# EAGLE design ErikSpark_AtTiny85 (EAGLE 7.6.0)
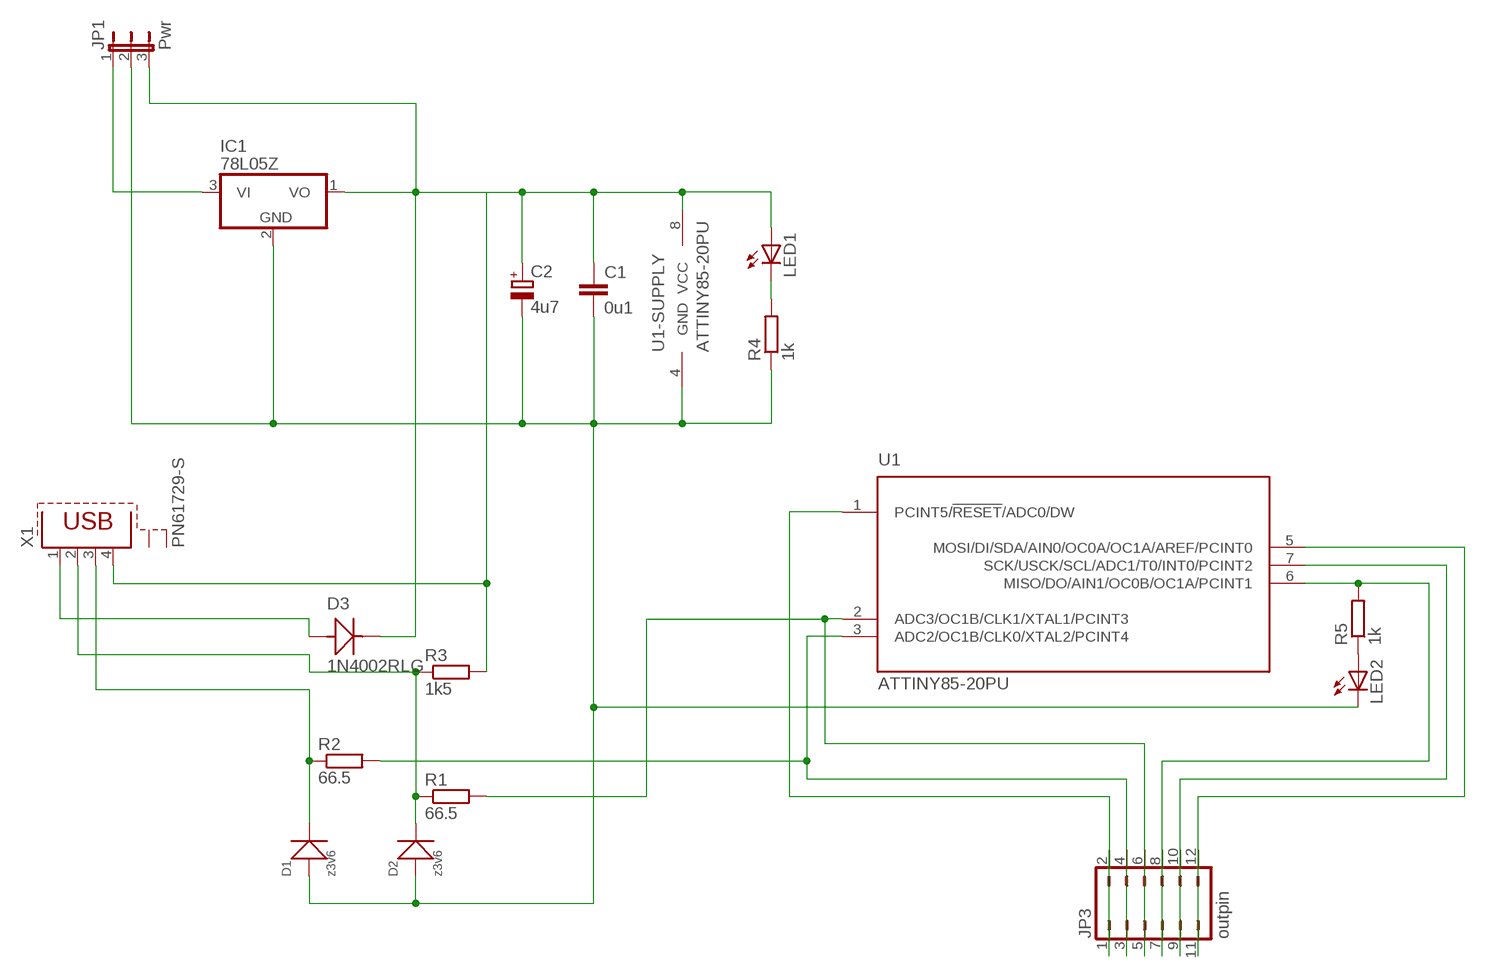
[diagram p0: schematic, sheet 1]

## Parts
C1  0u1  C-EU050-024X044  [C050-024X044]
C2  4u7  CPOL-EUE2-4  [E2-4]
D1  z3v6  DIP-DIODE-ZENER-3.6V-500MW(DO-35)  [DO-35]
D2  z3v6  DIP-DIODE-ZENER-3.6V-500MW(DO-35)  [DO-35]
D3  1N4002RLG  [DO-41]
IC1  78L05Z  [TO92]
JP1  Pwr  JP2E  [JP2]
JP3  outpin  JP6Q  [JP6Q]
LED1  LED3MM  [LED3MM]
LED2  LED3MM  [LED3MM]
R1  66.5  R-EU_0207/15  [0207/15]
R2  66.5  R-EU_0207/15  [0207/15]
R3  1k5  R-EU_0207/15  [0207/15]
R4  1k  R-EU_0207/15  [0207/15]
R5  1k  R-EU_0207/15  [0207/15]
U1  ATTINY85-20PU  [DIP-8]
X1  PN61729-S  [PN61729-S]

## Nets
N$1: C1.2 C2.- D1.A(+) D2.A(+) IC1.2(GND) JP1.2 LED2.K(C) R4.1 U1.4(GND)
N$2: D3.A X1.1
N$3: JP3.3 JP3.4 R2.2 U1.3(ADC2/OC1B/CLK0/XTAL2/PCINT4)
N$4: JP3.5 JP3.6 R1.2 U1.2(ADC3/OC1B/CLK1/XTAL1/PCINT3)
N$5: JP3.7 JP3.8 R5.2 U1.6(MISO/DO/AIN1/OC0B/OC1A/PCINT1)
N$6: JP3.9 JP3.10 U1.7(SCK/USCK/SCL/ADC1/T0/INT0/PCINT2)
N$7: JP3.11 JP3.12 U1.5(MOSI/DI/SDA/AIN0/OC0A/OC1A/AREF/PCINT0)
N$8: JP3.1 JP3.2 U1.1(PCINT5/!RESET!/ADC0/DW)
N$9: LED2.A R5.1
N$10: LED1.K(C) R4.2
N$11: D1.C(-) R2.1 X1.3
N$12: D2.C(-) R1.1 R3.1 X1.2
N$13: C1.1 C2.+ D3.C IC1.1(VO) JP1.3 LED1.A R3.2 U1.8(VCC) X1.4
N$17: IC1.3(VI) JP1.1
Unconnected: X1.S1 X1.S2

## Library data of the parts
C1 = rcl:C-EU: CAPACITOR, European symbol
C2 = rcl:CPOL-EU: POLARIZED CAPACITOR, European symbol
D1 D2 = Seeed-OPL-Diode:DIP-DIODE-ZENER-3.6V-500MW(DO-35): 304030011; MPN: 1N5227B; VALUE: 1N5227B
D3 = Volks73-ONSemiconductor:1N*?: Diode Axial Lead Standard Recovery Rectifiers Documentation Datasheet <http://www.onsemi.com/pub_link/Collateral/1N4001-D.PDF> Features Shipped in Plastic Bags, 1000 per bag Available Tape and Reeled, 5000 per reel, by adding a “RL” suffix to the part number Available in Fan−Fold Packaging, 3000 per box, by adding a “FF” suffix to the part number Pb−Free Packages are Available Mechanical Characteristics Case: Epoxy, Molded Weight: 0.4 gram (approximately) Finish: All External Surfaces Corrosion Resistant and Terminal Leads are Readily Solderable Lead and Mounting Surface Temperature for Soldering Purposes: 260°C Max. for 10 Seconds, 1/16 in. from case Polarity: Cathode Indicated by Polarity Band; CAPACITANCE: -; CATEGORY: Discrete Semiconductor Products; CURRENT-AVERAGE_RECTIFIED: 1A; CURRENT-REVERSE_LEAKAGE: 10uA @ 100V; DESCRIPTION: DIODE GEN PURP 100V 1A DO41; DIODE_TYPE: Standard; DOCUMENTATION_LINK: <a href="http://www.onsemi.com/pub_link/Collateral/1N4001-D.PDF">Datasheet</a>; DOCUMENTATION_URL: http://www.onsemi.com/pub_link/Collateral/1N4001-D.PDF; FAMILY: Diodes, Rectifiers, - Single; MANUFACTURER: ON Semiconductor; MOUNTING_TYPE: Through Hole; OPERATING_TEMPERATURE-JUNCTION: -64C ~ 175C; PACKAGE: DO-204AL, DO-41, Axial; PART_NUMBER: 1N4002RLG; REVERSE_RECOVERY-TIME: -; SERIES: -; SPEED: Standard Recovery >500ns, > 200mA (Io); SUPPLIER_DEVICE_PACKAGE: DO-41; SUPPLIER_ITEM_LINK: <a href="http://www.digikey.com/product-detail/en/1N4002RLG/1N4002RLGOSCT-ND/917622">Details</a>; SUPPLIER_ITEM_NUMBER: 1N4002RLGOSCT-ND; SUPPLIER_ITEM_URL: http://www.digikey.com/product-detail/en/1N4002RLG/1N4002RLGOSCT-ND/917622; SUPPLIER_LINK: <a href="http://www.digikey.com">Home Page</a>; SUPPLIER_NAME: Digi-Key; SUPPLIER_URL: http://www.digikey.com; VOLTAGE-DC_REVERSE: 100V; VOLTAGE-FORWARD: 1.1V @ 1A
IC1 = linear:78*: Positive VOLTAGE REGULATOR Source: http://cache.national.com/ds/LM/LM78L05.pdf http://www.fairchildsemi.com/ds/LM/LM7805.pdf
JP1 = jumper:JP2E: JUMPER
JP3 = jumper:JP6Q: JUMPER
LED1 LED2 = led:LED: LED OSRAM: - CHIPLED LG R971, LG N971, LY N971, LG Q971, LY Q971, LO R971, LY R971 LH N974, LH R974 LS Q976, LO Q976, LY Q976 LO Q996 - Hyper CHIPLED LW Q18S LB Q993, LB Q99A, LB R99A - SideLED LS A670, LO A670, LY A670, LG A670, LP A670 LB A673, LV A673, LT A673, LW A673 LH A674 LY A675 LS A676, LA A676, LO A676, LY A676, LW A676 LS A679, LY A679, LG A679 - Hyper Micro SIDELED® LS Y876, LA Y876, LO Y876, LY Y876 LT Y87S - SmartLED LW L88C, LW L88S LB L89C, LB L89S, LG L890 LS L89K, LO L89K, LY L89K LS L896, LA L896, LO L896, LY L896 - TOPLED LS T670, LO T670, LY T670, LG T670, LP T670 LSG T670, LSP T670, LSY T670, LOP T670, LYG T670 LG T671, LOG T671, LSG T671 LB T673, LV T673, LT T673, LW T673 LH T674 LS T676, LA T676, LO T676, LY T676, LB T676, LH T676, LSB T676, LW T676 LB T67C, LV T67C, LT T67C, LS T67K, LO T67K, LY T67K, LW E67C LS E67B, LA E67B, LO E67B, LY E67B, LB E67C, LV E67C, LT E67C LW T67C LS T679, LY T679, LG T679 LS T770, LO T770, LY T770, LG T770, LP T770 LB T773, LV T773, LT T773, LW T773 LH T774 LS E675, LA E675, LY E675, LS T675 LS T776, LA T776, LO T776, LY T776, LB T776 LHGB T686 LT T68C, LB T68C - Hyper Mini TOPLED® LB M676 - Mini TOPLED Santana® LG M470 LS M47K, LO M47K, LY M47K Source: http://www.osram.convergy.de LUXEON: - LUMILED® LXK2-PW12-R00, LXK2-PW12-S00, LXK2-PW14-U00, LXK2-PW14-V00 LXK2-PM12-R00, LXK2-PM12-S00, LXK2-PM14-U00 LXK2-PE12-Q00, LXK2-PE12-R00, LXK2-PE12-S00, LXK2-PE14-T00, LXK2-PE14-U00 LXK2-PB12-K00, LXK2-PB12-L00, LXK2-PB12-M00, LXK2-PB14-N00, LXK2-PB14-P00, LXK2-PB14-Q00 LXK2-PR12-L00, LXK2-PR12-M00, LXK2-PR14-Q00, LXK2-PR14-R00 LXK2-PD12-Q00, LXK2-PD12-R00, LXK2-PD12-S00 LXK2-PH12-R00, LXK2-PH12-S00 LXK2-PL12-P00, LXK2-PL12-Q00, LXK2-PL12-R00 Source: www.luxeon.com KINGBRIGHT: KA-3528ASYC Source: www.kingbright.com
R1-R5 = rcl:R-EU_: RESISTOR, European symbol
U1 = volks73-Atmel:ATTINY*5-?: AVR® ATtiny2/4/85 Microcontroller Atmel 8-bit AVR Microcontroller with 2/4/8K Bytes In-System Programmable Flash Documentation Datasheet <http://www.atmel.com/images/atmel-2586-avr-8-bit-microcontroller-attiny25-attiny45-attiny85_datasheet.pdf> Features High Performance, Low Power AVR® 8-Bit Microcontroller Advanced RISC Architecture 120 Powerful Instructions – Most Single Clock Cycle Execution 32 x 8 General Purpose Working Registers Fully Static Operation Non-volatile Program and Data Memories 2/4/8K Bytes of In-System Programmable Program Memory Flash Endurance: 10,000 Write/Erase Cycles 128/256/512 Bytes In-System Programmable EEPROM Endurance: 100,000 Write/Erase Cycles 128/256/512 Bytes Internal SRAM Programming Lock for Self-Programming Flash Program and EEPROM Data Security Peripheral Features 8-bit Timer/Counter with Prescaler and Two PWM Channels 8-bit High Speed Timer/Counter with Separate Prescaler 2 High Frequency PWM Outputs with Separate Output Compare Registers Programmable Dead Time Generator USI – Universal Serial Interface with Start Condition Detector 10-bit ADC 4 Single Ended Channels 2 Differential ADC Channel Pairs with Programmable Gain (1x, 20x) Temperature Measurement Programmable Watchdog Timer with Separate On-chip Oscillator On-chip Analog Comparator Special Microcontroller Features debugWIRE On-chip Debug System In-System Programmable via SPI Port External and Internal Interrupt Sources Low Power Idle, ADC Noise Reduction, and Power-down Modes Enhanced Power-on Reset Circuit Programmable Brown-out Detection Circuit Internal Calibrated Oscillator I/O and Packages Six Programmable I/O Lines 8-pin PDIP, 8-pin SOIC, 20-pad QFN/MLF, and 8-pin TSSOP (only ATtiny45/V) Operating Voltage 1.8 - 5.5V for ATtiny25V/45V/85V 2.7 - 5.5V for ATtiny25/45/85 Speed Grade ATtiny25V/45V/85V: 0 – 4 MHz @ 1.8 - 5.5V, 0 - 10 MHz @ 2.7 - 5.5V ATtiny25/45/85: 0 – 10 MHz @ 2.7 - 5.5V, 0 - 20 MHz @ 4.5 - 5.5V Industrial Temperature Range Low Power Consumption Active Mode: 1 MHz, 1.8V: 300 μA Power-down Mode: 0.1 μA at 1.8V; CONNECTIVITY: USI; CORE_PROCESSOR: AVR; CORE_SIZE: 8-Bit; DATA_CONVERTERS: A/D 4x10b; DESCRIPTION: IC MCU 8BIT 8KB FLASH 8DIP; DOCUMENTATION_LINK: <a href="http://www.atmel.com/images/atmel-2586-avr-8-bit-microcontroller-attiny25-attiny45-attiny85_datasheet.pdf">Datasheet</a>; DOCUMENTATION_URL: http://www.atmel.com/images/atmel-2586-avr-8-bit-microcontroller-attiny25-attiny45-attiny85_datasheet.pdf; EEPROM_SIZE: 512 x 8; MANUFACTURER: Atmel; NUMBER_OF_IO: 6; OPERATING_TEMPERATURE: -40C ~ 85C; OSCILLATOR_TYPE: Internal; PACKAGE: 8-DIP (0.300", 7.62mm); PART_NUMBER: ATTINY85-20PU; PERIPHERALS: Brown-out Detect/Reset, POR, PWM, WDT; PROGRAM_MEMORY_SIZE: 8KB (4K x 16); PROGRAM_MEMORY_TYPE: FLASH; RAM_SIZE: 512 x 8; SPEED: 20MHz; SUPPLIER_DEVICE_PACKAGE: 8-PDIP; SUPPLIER_ITEM_LINK: <a href="http://www.digikey.com/product-detail/en/ATTINY85-20PU/ATTINY85-20PU-ND/735469">Details</a>; SUPPLIER_ITEM_NUMBER: ATTINY85-20PU-ND; SUPPLIER_ITEM_URL: http://www.digikey.com/product-detail/en/ATTINY85-20PU/ATTINY85-20PU-ND/735469; SUPPLIER_LINK: <a href="http://www.digikey.com">Home Page</a>; SUPPLIER_NAME: Digi-Key; SUPPLIER_URL: http://www.digikey.com; VOLTAGE-SUPPLY: 2.7 ~ 5.5V
X1 = con-berg:PN61729-S: BERG USB connector; OC_FARNELL: unknown; OC_NEWARK: unknown

## Board
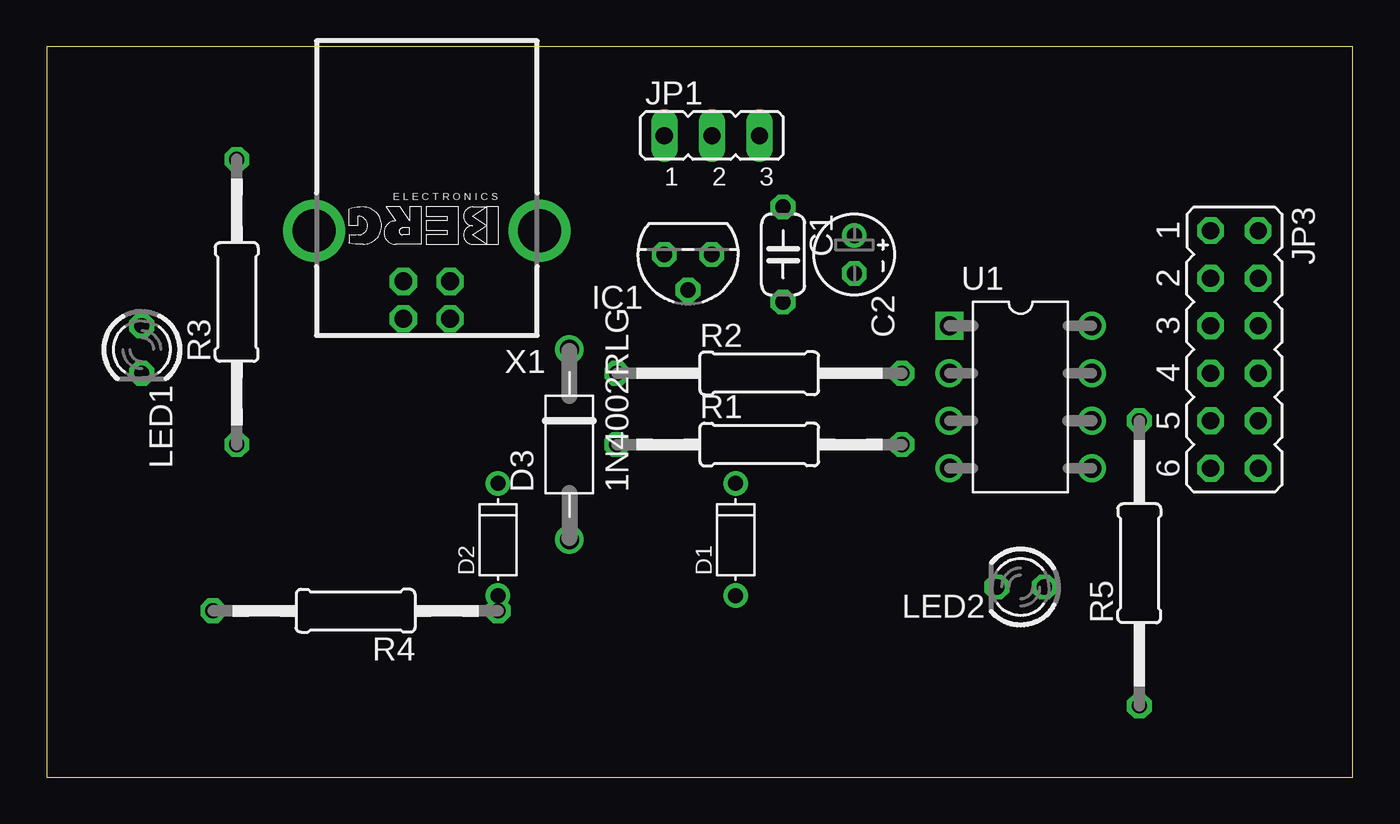
[diagram p1: board, top side]
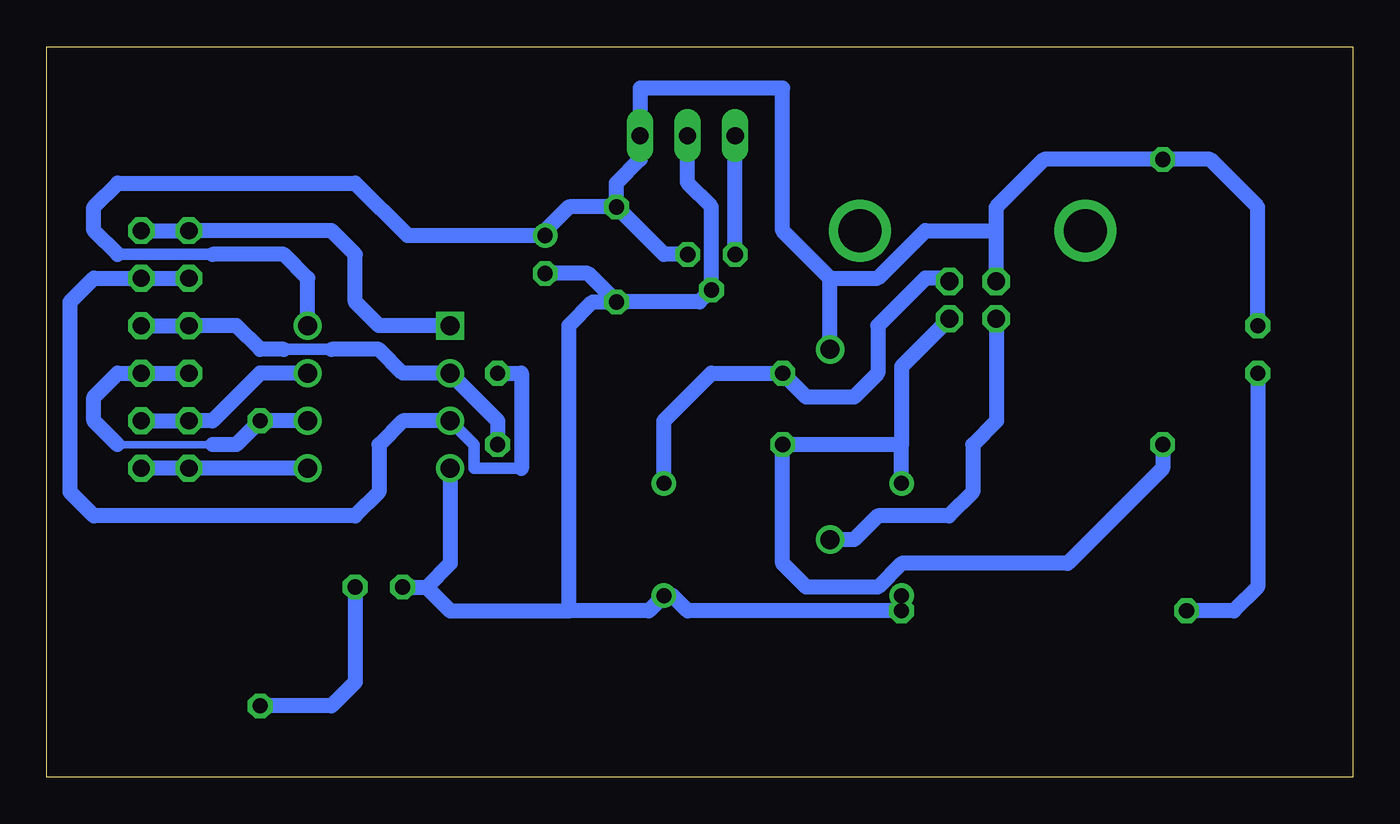
[diagram p2: board, bottom side, seen from below]

Size 69.83 x 39.04 mm. Coordinates in mm from the lower left corner, seen from the top.
Outline: 0,0 69.83,0 69.83,39.04 0,39.04 0,0
Copper layers (1*16): Top 0.035mm / dielectric 1.5mm / Bottom 0.035mm
Design rules "default": minimum track width 10mil, minimum drill 24mil, track to track 8mil, track to pad 8mil, pad to pad 8mil, via to via 8mil, smd to smd 8mil, copper to edge 40mil, drill to drill 8mil, minimum pad ring 10mil, minimum via ring 8mil, stop-mask expansion 4mil, vias tented up to drill 0mil, thermal gap 10mil

### Footprints (pad centres in the part's own frame; a part is rotated, then mirrored left to right if it is on the bottom)
C050-024X044 = drill 0.813 octagon: 1 -2.54,0; 2 2.54,0
E2-4 = drill 0.813 pad 1.27: + -1.016,0 | drill 0.813 pad 1.27 octagon: - 1.016,0
DO-35 = drill 0.8: A -3,0; C 3,0
DO-41 = drill 1.016: A 0,-5.08; C 0,5.08
TO92 = drill 0.813 octagon: 1 -1.27,0; 2 0,1.905; 3 1.27,0
JP2 = drill 0.914 long: 1 -2.54,0; 2 0,0; 3 2.54,0
JP6Q = drill 0.914 octagon: 1 -6.35,-1.27; 2 -6.35,1.27; 3 -3.81,-1.27; 4 -3.81,1.27; 5 -1.27,-1.27; 6 -1.27,1.27; 7 1.27,-1.27; 8 1.27,1.27; 9 3.81,-1.27; 10 3.81,1.27; 11 6.35,-1.27; 12 6.35,1.27
LED3MM = drill 0.813 octagon: A -1.27,0; K 1.27,0
0207/15 = drill 0.813 octagon: 1 -7.62,0; 2 7.62,0
DIP-8 = drill 1 square: 1 -3.81,3.81 | drill 1: 2 -3.81,1.27; 3 -3.81,-1.27; 4 -3.81,-3.81; 5 3.81,-3.81; 6 3.81,-1.27; 7 3.81,1.27; 8 3.81,3.81
PN61729-S = drill 0.95 octagon: 1 1.25,4.71; 2 -1.25,4.71; 3 -1.25,2.71; 4 1.25,2.71 | drill 2.3 pad 2.9: S1 -6.02,0; S2 6.02,0

### Placement (x,y rotation side)
C1  39.37,27.94 270 top
C2  43.18,27.94 270 top
D1  36.83,12.7 90 top
D2  24.13,12.7 90 top
D3  27.94,17.78 0 top
IC1  34.29,27.94 180 top
JP1  35.56,34.29 0 top
JP3  63.5,22.86 270 top
LED1  5.08,22.86 270 top
LED2  52.07,10.16 180 top
R1  38.1,17.78 0 top
R2  38.1,21.59 0 top
R3  10.16,25.4 90 top
R4  16.51,8.89 180 top
R5  58.42,11.43 90 top
U1  52.07,20.32 0 top
X1  20.32,29.21 180 top

### Tracks (layer width: path | path; a pad name or v marks a point on that pad's centre or on a via)
N$1
  Bottom 0.813: C1.2 34.92,25.4 IC1.2 34.29,30.48 35.56,31.75 JP1.2 | C1.2 40.89,26.92 C2.- | LED2.K 49.53,10.16 | 41.91,8.89 37.64,8.89 D1.A 36.37,9.7 35.56,8.89 R4.1 D2.A | U1.4 48.26,11.43 49.53,10.16 | 49.53,10.16 48.26,8.89 41.91,8.89 | 41.91,8.89 41.91,24.13 40.64,25.4 C1.2
N$2
  Bottom 0.813: X1.1 19.05,24.48 19.05,19.05 20.32,17.78 20.32,15.24 21.59,13.97 25.4,13.97 26.67,12.7 D3.A
N$3
  Bottom 0.61: 44.45,16.51 46.99,16.51 46.99,17.78 U1.3
  Bottom 0.813: JP3.3 JP3.4 67.31,26.67 68.58,25.4 68.58,15.24 67.31,13.97 53.34,13.97 52.07,15.24 52.07,17.78 50.8,19.05 U1.3 | R2.2 44.45,21.59 44.45,16.51
N$4
  Bottom 0.61: 54.61,22.86 57.15,22.86
  Bottom 0.813: JP3.6 JP3.5 59.69,24.13 58.42,22.86 57.15,22.86 | R1.2 45.72,19.05 U1.2 50.8,21.59 52.07,22.86 54.61,22.86
N$5
  Bottom 0.406: 60.96,17.78 66.04,17.78
  Bottom 0.813: JP3.7 JP3.8 66.04,21.59 67.31,20.32 67.31,19.05 66.04,17.78 | U1.6 R5.2 59.69,17.78 60.96,17.78
N$6
  Bottom 0.813: JP3.10 JP3.9 60.96,19.05 58.42,21.59 U1.7
N$7
  Bottom 0.813: U1.5 JP3.11 JP3.12
N$8
  Bottom 0.813: JP3.2 JP3.1 54.61,29.21 53.34,27.94 53.34,25.4 52.07,24.13 U1.1
N$9
  Bottom 0.813: LED2.A 53.34,5.08 54.61,3.81 R5.1
N$10
  Bottom 0.813: LED1.K 5.08,10.16 6.35,8.89 R4.2
N$11
  Bottom 0.813: D1.C 36.83,19.05 34.29,21.59 R2.1 29.21,20.32 26.67,20.32 25.4,21.59 25.4,24.13 22.86,26.67 21.74,26.67 X1.3
N$12
  Bottom 0.813: X1.2 24.13,21.94 24.13,17.78 | R3.1 10.16,16.51 15.24,11.43 24.13,11.43 25.4,10.16 29.21,10.16 30.48,11.43 R1.1 24.13,17.78 | D2.C 24.13,17.78
N$13
  Bottom 0.61: 60.96,27.94 66.04,27.94
  Bottom 0.813: 19.07,29.21 19.07,30.46 16.51,33.02 R3.2 7.62,33.02 5.08,30.48 LED1.A | 19.07,29.21 X1.4 | D3.C 27.94,26.67 | 27.94,26.67 25.4,26.67 22.86,29.21 19.07,29.21 | C1.1 39.37,31.75 38.1,33.02 JP1.3 38.1,36.83 30.48,36.83 30.48,29.21 27.94,26.67 | C1.1 41.91,30.48 43.18,29.21 C2.+ 50.55,28.96 53.34,31.75 66.04,31.75 67.31,30.48 67.31,29.21 66.04,27.94 | IC1.1 36.83,27.94 C1.1 | U1.8 55.88,26.67 57.15,27.94 60.96,27.94
N$17
  Bottom 0.813: IC1.3 JP1.1